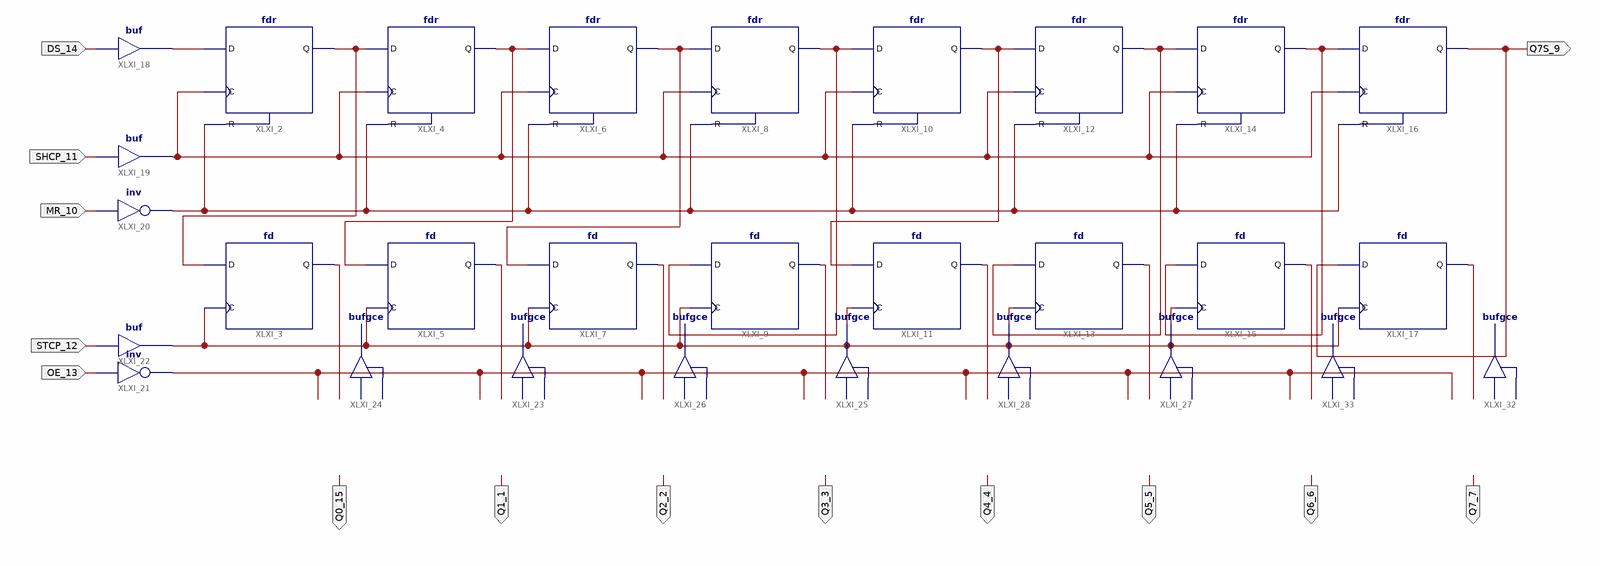
[diagram p0: schematic sheet 1]
// Xilinx ISE schematic A595.sch (spartan6) as structural Verilog: 29 symbols, 14 ports
module A595 (
  input  DS_14,
  input  SHCP_11,
  input  MR_10,
  input  OE_13,
  input  STCP_12,
  output Q7S_9,
  output Q1_1,
  output Q0_15,
  output Q3_3,
  output Q2_2,
  output Q5_5,
  output Q4_4,
  output Q6_6,
  output Q7_7
);

  wire XLXN_1, XLXN_2, XLXN_11, XLXN_16, XLXN_17, XLXN_18, XLXN_19, XLXN_20, XLXN_21, XLXN_22, XLXN_23,
       XLXN_24, XLXN_26, XLXN_28, XLXN_30, XLXN_32, XLXN_34, XLXN_36, XLXN_38, XLXN_41;

  fdr XLXI_2 (.C(XLXN_11), .D(XLXN_1), .R(XLXN_2), .Q(XLXN_26));
  fd XLXI_3 (.C(XLXN_16), .D(XLXN_26), .Q(XLXN_20));
  fdr XLXI_4 (.C(XLXN_11), .D(XLXN_26), .R(XLXN_2), .Q(XLXN_28));
  fd XLXI_5 (.C(XLXN_16), .D(XLXN_28), .Q(XLXN_21));
  fdr XLXI_6 (.C(XLXN_11), .D(XLXN_28), .R(XLXN_2), .Q(XLXN_30));
  fd XLXI_7 (.C(XLXN_16), .D(XLXN_30), .Q(XLXN_22));
  fdr XLXI_8 (.C(XLXN_11), .D(XLXN_30), .R(XLXN_2), .Q(XLXN_32));
  fd XLXI_9 (.C(XLXN_16), .D(XLXN_32), .Q(XLXN_23));
  fdr XLXI_10 (.C(XLXN_11), .D(XLXN_32), .R(XLXN_2), .Q(XLXN_34));
  fd XLXI_11 (.C(XLXN_16), .D(XLXN_34), .Q(XLXN_24));
  fdr XLXI_12 (.C(XLXN_11), .D(XLXN_34), .R(XLXN_2), .Q(XLXN_36));
  fd XLXI_13 (.C(XLXN_16), .D(XLXN_36), .Q(XLXN_18));
  fdr XLXI_14 (.C(XLXN_11), .D(XLXN_36), .R(XLXN_2), .Q(XLXN_38));
  fd XLXI_15 (.C(XLXN_16), .D(XLXN_38), .Q(XLXN_17));
  fdr XLXI_16 (.C(XLXN_11), .D(XLXN_38), .R(XLXN_2), .Q(Q7S_9));
  fd XLXI_17 (.C(XLXN_16), .D(Q7S_9), .Q(XLXN_19));
  buf XLXI_18 (XLXN_1, DS_14);
  buf XLXI_19 (XLXN_11, SHCP_11);
  not XLXI_20 (XLXN_2, MR_10);
  not XLXI_21 (XLXN_41, OE_13);
  buf XLXI_22 (XLXN_16, STCP_12);
  bufgce XLXI_23 (.CE(XLXN_41), .I(XLXN_21), .O(Q1_1));
  bufgce XLXI_24 (.CE(XLXN_41), .I(XLXN_20), .O(Q0_15));
  bufgce XLXI_25 (.CE(XLXN_41), .I(XLXN_23), .O(Q3_3));
  bufgce XLXI_26 (.CE(XLXN_41), .I(XLXN_22), .O(Q2_2));
  bufgce XLXI_27 (.CE(XLXN_41), .I(XLXN_18), .O(Q5_5));
  bufgce XLXI_28 (.CE(XLXN_41), .I(XLXN_24), .O(Q4_4));
  bufgce XLXI_32 (.CE(XLXN_41), .I(XLXN_19), .O(Q7_7));
  bufgce XLXI_33 (.CE(XLXN_41), .I(XLXN_17), .O(Q6_6));
endmodule
